# EAGLE design C64toUSBKeyboard (EAGLE 7.7.0)
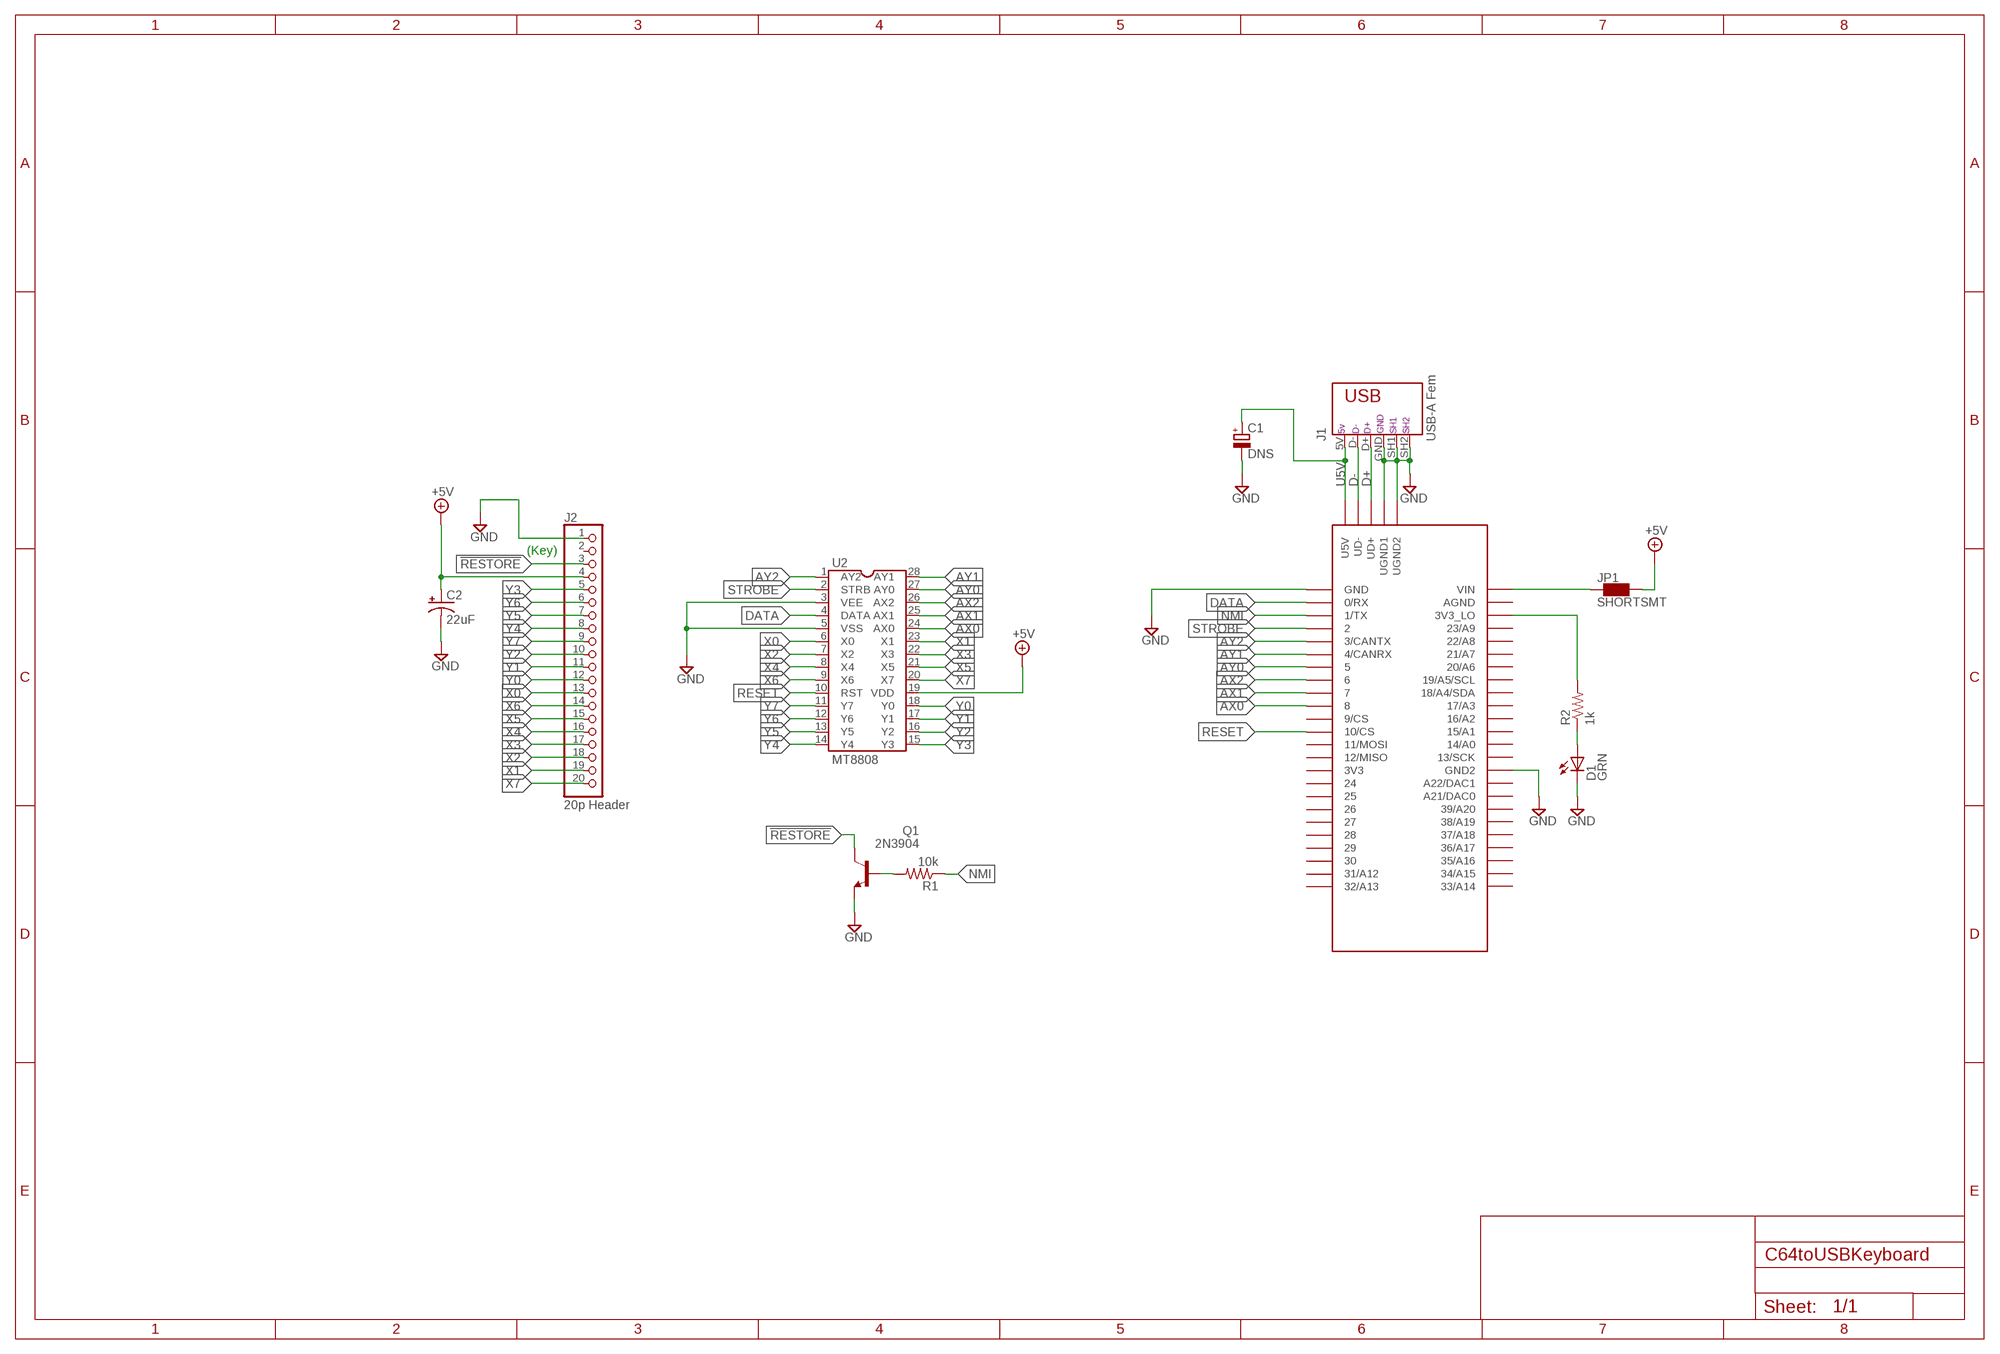
[diagram p0: schematic, sheet 1]

## Parts
C1  DNS  CPOL-EUA/3216-18W  [A/3216-18W]
C2  22uF  CPOL-USE2.5-6  [E2,5-6]
D1  GRN  LED-3MM-GRN  [LED-3MM-PTH]
J1  USB-A Fem  USB-787616  [USB]
J2  20p Header  HEADER-1X20ROUND  [1X20_ROUND]
JP1  SHORTSMT  [SHORT]
Q1  2N3904  [TO92]
R1  10k  R-US_0207/10  [0207/10]
R2  1k  R-US_0207/10  [0207/10]
U1  TEENSY_3.6_4.1  TEENSY_3.5/3.6  [TEENSY_3.5/3.6]
U2  MT8808  DIL28  [DIL28-6]

## Nets
3V3: R2.2 U1.3V3_LO
5V_TEENSY: JP1.1 U1.VIN
!RESTORE: J2.3 Q1.1(C)
+5V: C2.+ J2.4 JP1.2 U2.19(VDD)
AX0: U1.8 U2.24(AX0)
AX1: U1.7 U2.25(AX1)
AX2: U1.6 U2.26(AX2)
AY0: U1.5 U2.27(AY0)
AY1: U1.4/CANRX U2.28(AY1)
AY2: U1.3/CANTX U2.1(AY2)
D+: J1.D+ U1.UD+
D-: J1.D- U1.UD-
DATA: U1.0/RX U2.4(DATA)
GND: C1.- C2.- D1.K(C) J1.GND J1.SH1 J1.SH2 J2.1 Q1.3(E) U1.GND U1.GND2 U1.UGND1 U1.UGND2 U2.3(VEE) U2.5(VSS)
LED_R: D1.A R2.1
NMI: R1.1 U1.1/TX
NMI_R: Q1.2(B) R1.2
RESET: U1.10/CS U2.10(RST)
STROBE: U1.2 U2.2(STRB)
U5V: C1.+ J1.5V U1.U5V
X0: J2.13 U2.6(X0)
X1: J2.19 U2.23(X1)
X2: J2.18 U2.7(X2)
X3: J2.17 U2.22(X3)
X4: J2.16 U2.8(X4)
X5: J2.15 U2.21(X5)
X6: J2.14 U2.9(X6)
X7: J2.20 U2.20(X7)
Y0: J2.12 U2.18(Y0)
Y1: J2.11 U2.17(Y1)
Y2: J2.10 U2.16(Y2)
Y3: J2.5 U2.15(Y3)
Y4: J2.8 U2.14(Y4)
Y5: J2.7 U2.13(Y5)
Y6: J2.6 U2.12(Y6)
Y7: J2.9 U2.11(Y7)
Unconnected: J2.2 U1.3V3 U1.9/CS U1.11/MOSI U1.12/MISO U1.13/SCK U1.14/A0 U1.15/A1 U1.16/A2 U1.17/A3 U1.18/A4/SDA U1.19/A5/SCL U1.20/A6 U1.21/A7 U1.21/DAC0(A21/DAC0) U1.22/A8 U1.23/A9 U1.24 U1.25 U1.26 U1.27 U1.28 U1.29 U1.30 U1.31/A12 U1.32/A13 U1.33/A14 U1.34/A15 U1.35/A16 U1.36/A17 U1.37/A18 U1.38/A19 U1.39/A20 U1.A22/DAC1 U1.AGND

## Notes on the sheet
- (Key)

## Library data of the parts
C1 = rcl:CPOL-EU: POLARIZED CAPACITOR, European symbol
C2 = C64toUSBKeyboard:CPOL-US: POLARIZED CAPACITOR, American symbol
D1 = Dolphin v3.20:LED-3MM-: LED 3.1MM PTH; DIGIKEY: 516-1293-ND; MANUF1: Broadcom Limited; MPN1: HLMP-1503
J1 = AudioLooper:USB-787616: AMP connector
J2 = microbuilder:HEADER-1X20
JP1 = TeensyROM:SHORT
Q1 = C64toUSBKeyboard:2N3904: NPN TRANSISTOR
R1 R2 = resistor:R-US_: RESISTOR, American symbol
U1 = C64toUSBKeyboard:TEENSY_3.5/3.6
U2 = C64toUSBKeyboard:DIL28: Dual In Line

## Net classes
1 vcc: width 0.254 mm

## Board
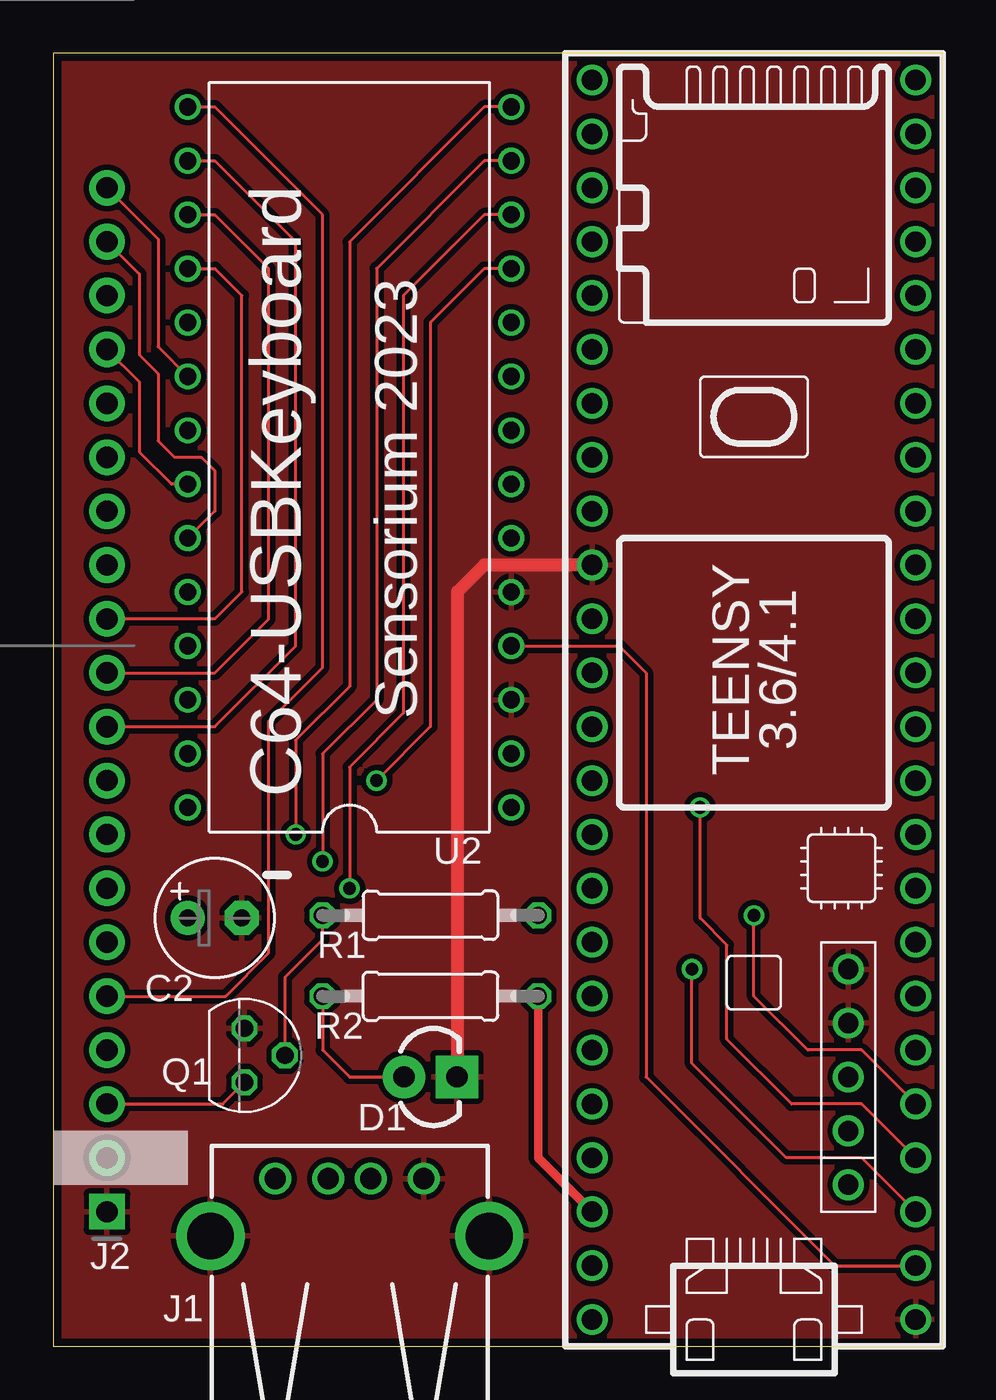
[diagram p1: board, top side]
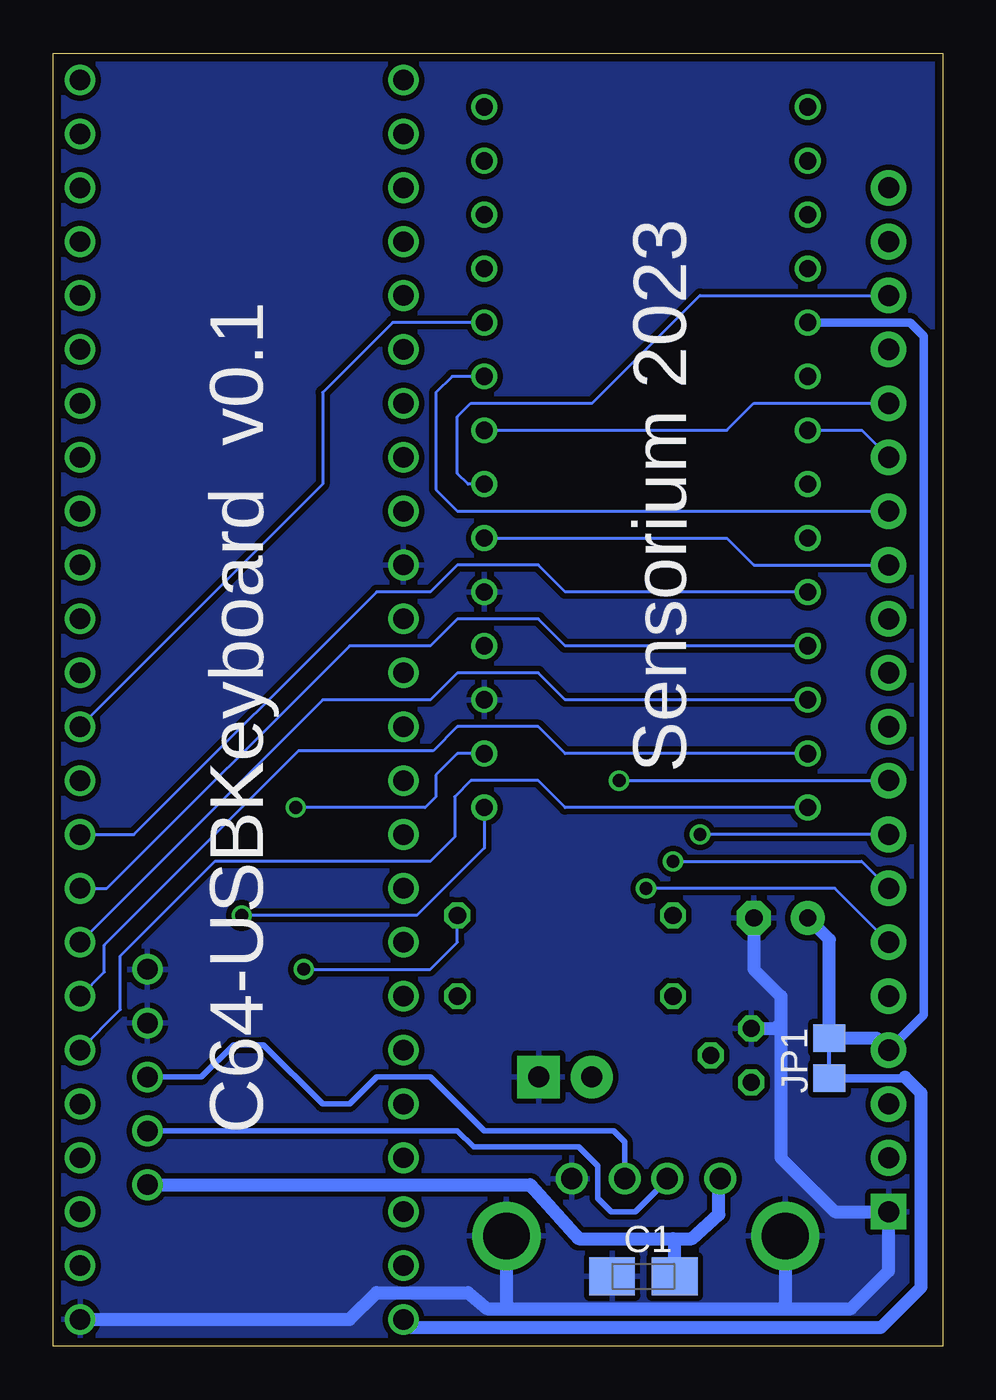
[diagram p2: board, bottom side, seen from below]

Size 41.91 x 60.96 mm. Coordinates in mm from the lower left corner, seen from the top.
Outline: 0,60.96 0,0 41.91,0 41.91,60.96 0,60.96
Copper layers (1*16): Top 0.0356mm / dielectric 1.5011mm / Bottom 0.0356mm
Design rules "oshpark-2layer *": minimum track width 6mil, minimum drill 13mil, track to track 6mil, track to pad 6mil, pad to pad 6mil, via to via 6mil, smd to smd 6mil, copper to edge 15mil, drill to drill 6mil, minimum pad ring 7mil, minimum via ring 7mil, stop-mask expansion 2.5mil, vias tented up to drill 25mil, thermal gap 10mil

### Footprints (pad centres in the part's own frame; a part is rotated, then mirrored left to right if it is on the bottom)
A/3216-18W = smd 2.15 x 1.8: + 1.475,0; - -1.475,0
E2,5-6 = drill 0.813 pad 1.6: + -1.27,0 | drill 0.813 pad 1.6 octagon: - 1.27,0
LED-3MM-PTH = drill 1 pad 2: A -1.25,0 | drill 1 pad 2 square: K 1.25,0
USB = drill 1: 5V -3.5,12.99; D+ 1,12.99; D- -1,12.99; GND 3.5,12.99 | drill 2.2: SH1 -6.553,10.287; SH2 6.579,10.287
1X20_ROUND = drill 1 pad 1.676 square: 1 -24.13,0 | drill 1 pad 1.676: 2 -21.59,0; 3 -19.05,0; 4 -16.51,0; 5 -13.97,0; 6 -11.43,0; 7 -8.89,0; 8 -6.35,0; 9 -3.81,0; 10 -1.27,0; 11 1.27,0; 12 3.81,0; 13 6.35,0; 14 8.89,0; 15 11.43,0; 16 13.97,0; 17 16.51,0; 18 19.05,0; 19 21.59,0; 20 24.13,0
SHORT = smd 1.3 x 1.5: 1 -0.95,0; 2 0.95,0
TO92 = drill 0.813 octagon: 1 1.27,0; 2 0,1.905; 3 -1.27,0
0207/10 = drill 0.813 octagon: 1 -5.08,0; 2 5.08,0
TEENSY_3.5/3.6 = drill 0.965: 0/RX -25.4,-7.62; 1/TX -22.86,-7.62; 2 -20.32,-7.62; 3/CANTX -17.78,-7.62; 3V3 7.62,-7.62; 3V3_LO -22.86,7.62; 4/CANRX -15.24,-7.62; 5 -12.7,-7.62; 6 -10.16,-7.62; 7 -7.62,-7.62; 8 -5.08,-7.62; 9/CS -2.54,-7.62; 10/CS 0,-7.62; 11/MOSI 2.54,-7.62; 12/MISO 5.08,-7.62; 13/SCK 5.08,7.62; 14/A0 2.54,7.62; 15/A1 0,7.62; 16/A2 -2.54,7.62; 17/A3 -5.08,7.62; 18/A4/SDA -7.62,7.62; 19/A5/SCL -10.16,7.62; 20/A6 -12.7,7.62; 21/A7 -15.24,7.62; 21/DAC0 12.7,7.62; 22/A8 -17.78,7.62; 23/A9 -20.32,7.62; 24 10.16,-7.62; 25 12.7,-7.62; 26 15.24,-7.62; 27 17.78,-7.62; 28 20.32,-7.62; 29 22.86,-7.62; 30 25.4,-7.62; 31/A12 27.94,-7.62; 32/A13 30.48,-7.62; 33/A14 30.48,7.62; 34/A15 27.94,7.62; 35/A16 25.4,7.62; 36/A17 22.86,7.62; 37/A18 20.32,7.62; 38/A19 17.78,7.62; 39/A20 15.24,7.62; A22/DAC1 10.16,7.62; AGND -25.4,7.62; GND -27.94,-7.62; GND2 7.62,7.62; U5V -21.59,-4.445; UD+ -16.51,-4.445; UD- -19.05,-4.445; UGND1 -13.97,-4.445; UGND2 -11.43,-4.445; VIN -27.94,7.62
DIL28-6 = drill 0.813: 1 -16.51,-7.62; 2 -13.97,-7.62; 3 -11.43,-7.62; 4 -8.89,-7.62; 5 -6.35,-7.62; 6 -3.81,-7.62; 7 -1.27,-7.62; 8 1.27,-7.62; 9 3.81,-7.62; 10 6.35,-7.62; 11 8.89,-7.62; 12 11.43,-7.62; 13 13.97,-7.62; 14 16.51,-7.62; 15 16.51,7.62; 16 13.97,7.62; 17 11.43,7.62; 18 8.89,7.62; 19 6.35,7.62; 20 3.81,7.62; 21 1.27,7.62; 22 -1.27,7.62; 23 -3.81,7.62; 24 -6.35,7.62; 25 -8.89,7.62; 26 -11.43,7.62; 27 -13.97,7.62; 28 -16.51,7.62

### Placement (x,y rotation side)
C1  14.1,3.3 0 bottom
C2  7.62,20.19 0 top
D1  17.78,12.7 0 top
J1  13.97,-5.08 0 top
J2  2.54,30.48 90 top
JP1  5.33,13.59 90 bottom
Q1  9.02,13.72 270 top
R1  17.78,20.32 180 top
R2  17.78,16.51 0 top
U1  33.02,29.21 90 top
U2  13.97,41.91 90 top

### Tracks (layer width: path | path; a pad name or v marks a point on that pad's centre or on a via)
3V3
  Top 0.406: R2.2 22.86,8.89 U1.3V3_LO
5V_TEENSY
  Bottom 0.406: JP1.1 1.78,12.64 1.78,12.7
  Bottom 0.61: 1.78,12.7 1.02,11.94 1.02,2.79 2.92,0.89 25.02,0.89 U1.VIN
!RESTORE
  Top 0.152: J2.3 8,11.43 Q1.1
+5V
  Bottom 0.406: J2.4 0.89,15.62 0.89,47.62 1.52,48.26 U2.19
  Bottom 0.61: J2.4 3.11,14.54 JP1.2 5.33,19.18 C2.+
AX0
  Bottom 0.152: U1.8 38.1,24.13 26.67,35.56 24.13,35.56 22.86,36.83 19.05,36.83 17.78,35.56 U2.24
AX1
  Bottom 0.152: U1.7 39.37,21.59 27.94,33.02 24.13,33.02 22.86,34.29 19.05,34.29 17.78,33.02 U2.25
AX2
  Bottom 0.152: U1.6 29.21,30.48 24.13,30.48 22.86,31.75 19.05,31.75 17.78,30.48 U2.26
AY0
  Bottom 0.152: U1.5 39.5,17.65 39.5,18.92 30.35,28.07 24,28.07 22.86,29.21 19.05,29.21 17.78,27.94 U2.27
AY1
  Bottom 0.152: U1.4/CANRX 38.73,15.88 38.73,18.41 34.29,22.86 24.13,22.86 22.99,24 22.99,25.91 22.23,26.67 19.05,26.67 17.78,25.4 U2.28
AY2  (via drill 0.6)
  Top 0.152: U1.3/CANTX 38.1,13.97 35.56,13.97 33.02,16.51 v33.02,20.32
  Bottom 0.152: U2.1 21.59,23.5 24.77,20.32 v33.02,20.32
D+
  Bottom 0.254: U1.UD+ 34.92,12.7 33.4,14.22 32,14.22 29.21,11.43 27.94,11.43 26.67,12.7 24.13,12.7 21.59,10.16 15.49,10.16 14.99,9.65 14.99,7.93 J1.D+
D-
  Bottom 0.254: U1.UD- 22.86,10.16 22.1,9.4 17.14,9.4 16.26,8.51 16.26,6.99 15.62,6.35 14.48,6.35 12.97,7.86 J1.D-
DATA
  Top 0.152: U1.0/RX 36.83,3.81 27.94,12.7 27.94,31.75 26.67,33.02 U2.4
GND
  Top 0.61: U1.GND2 20.32,36.83 19.05,35.56 19.05,12.72 D1.K
  Bottom 0.61: U1.GND 27.94,1.27 26.67,2.54 22.35,2.54 21.46,1.78 20.32,1.78 | 20.32,1.78 7.62,1.78 | 7.62,1.78 4.32,1.78 2.54,3.56 J2.1 5.08,6.35 7.62,8.89 7.62,15.24 | J1.SH2 20.55,2.01 20.32,1.78 | J1.SH1 7.42,1.98 7.62,1.78 | C2.- 8.89,17.78 7.62,16.51 7.62,15.24 | Q1.3 7.87,14.99 7.62,15.24
  pour Bottom (isolate 0.254): 0,0 41.91,0 41.91,60.96 0,60.96
  pour Top (isolate 0.254): 0,0 41.91,0 41.91,60.96 0,60.96
LED_R
  Top 0.152: R2.1 12.7,13.97 13.97,12.7 D1.A
NMI  (via drill 0.6)
  Top 0.152: U1.1/TX 38.1,8.89 34.54,8.89 30.1,13.34 v30.1,17.78
  Bottom 0.152: v30.1,17.78 24.13,17.78 22.86,19.05 R1.1
NMI_R
  Top 0.152: R1.2 12.7,19.18 10.92,17.4 Q1.2
RESET
  Bottom 0.152: U1.10/CS 29.21,40.64 29.21,44.96 25.91,48.26 U2.10
STROBE  (via drill 0.6)
  Top 0.152: U1.2 38.1,11.43 34.8,11.43 31.75,14.48 31.75,18.92 30.48,20.19 v30.48,25.4
  Bottom 0.152: U2.2 22.86,27.94 23.88,26.92 23.88,25.91 24.38,25.4 v30.48,25.4
U5V
  Bottom 0.61: U1.U5V 19.43,7.62 17.14,5.08 12.7,5.08 | 12.7,5.08 11.81,5.08 10.54,6.22 10.54,7.84 J1.5V | C1.+ 12.62,5 12.7,5.08
X0
  Bottom 0.152: J2.13 8.89,36.83 10.16,38.1 U2.6
X1
  Top 0.152: J2.19 4.06,50.55 4.06,46.74 4.95,45.85 4.95,42.67 5.71,41.91 6.99,41.91 7.62,41.27 7.62,39.37 U2.23
X2
  Bottom 0.152: J2.18 11.43,49.53 16.51,44.45 22.23,44.45 22.86,43.81 22.86,41.15 22.35,40.64 U2.7
X3
  Top 0.152: J2.17 4.06,45.47 4.06,42.16 5.59,40.64 U2.22
X4
  Bottom 0.152: J2.16 8.89,44.45 10.16,43.18 U2.8
X5
  Bottom 0.152: J2.15 3.81,43.18 U2.21
X6
  Bottom 0.152: J2.14 22.86,39.37 23.88,40.39 23.88,44.96 23.11,45.72 U2.9
X7
  Top 0.152: J2.20 4.95,52.2 4.95,47.12 U2.20
Y0
  Top 0.152: J2.12 7.62,34.29 8.89,35.56 8.89,49.53 7.62,50.8 U2.18
Y1
  Top 0.152: J2.11 7.62,31.75 10.16,34.29 10.16,50.8 7.62,53.34 U2.17
Y2
  Top 0.152: J2.10 7.62,29.21 11.43,33.02 11.43,52.07 7.62,55.88 U2.16
Y3
  Top 0.152: J2.5 8.13,16.51 10.16,18.54 10.16,29.46 12.7,32 12.7,53.34 7.62,58.42 U2.15
Y4  (via drill 0.6)
  Top 0.152: v11.43,24.13 11.43,28.57 13.97,31.11 13.97,52.07 20.32,58.42 U2.14
  Bottom 0.152: J2.8 v11.43,24.13
Y5  (via drill 0.6)
  Top 0.152: v12.7,22.86 12.7,27.94 15.24,30.48 15.24,50.8 20.32,55.88 U2.13
  Bottom 0.152: v12.7,22.86 3.81,22.86 J2.7
Y6  (via drill 0.6)
  Top 0.152: v13.97,21.59 13.97,27.3 16.51,29.84 16.51,49.53 20.32,53.34 U2.12
  Bottom 0.152: J2.6 5.08,21.59 v13.97,21.59
Y7  (via drill 0.6)
  Top 0.152: v15.24,26.67 17.78,29.21 17.78,48.26 20.32,50.8 U2.11
  Bottom 0.152: v15.24,26.67 J2.9

### Text on the board
tPlace: Sensorium 2023 | C64-USBKeyboard
bPlace: Sensorium 2023 | C64-USBKeyboard v0.1